# Altium schematic sheet I3C_and_I2C_Slaves.SchDoc
size A4; MPS_Contact: www.monolithicpower.com
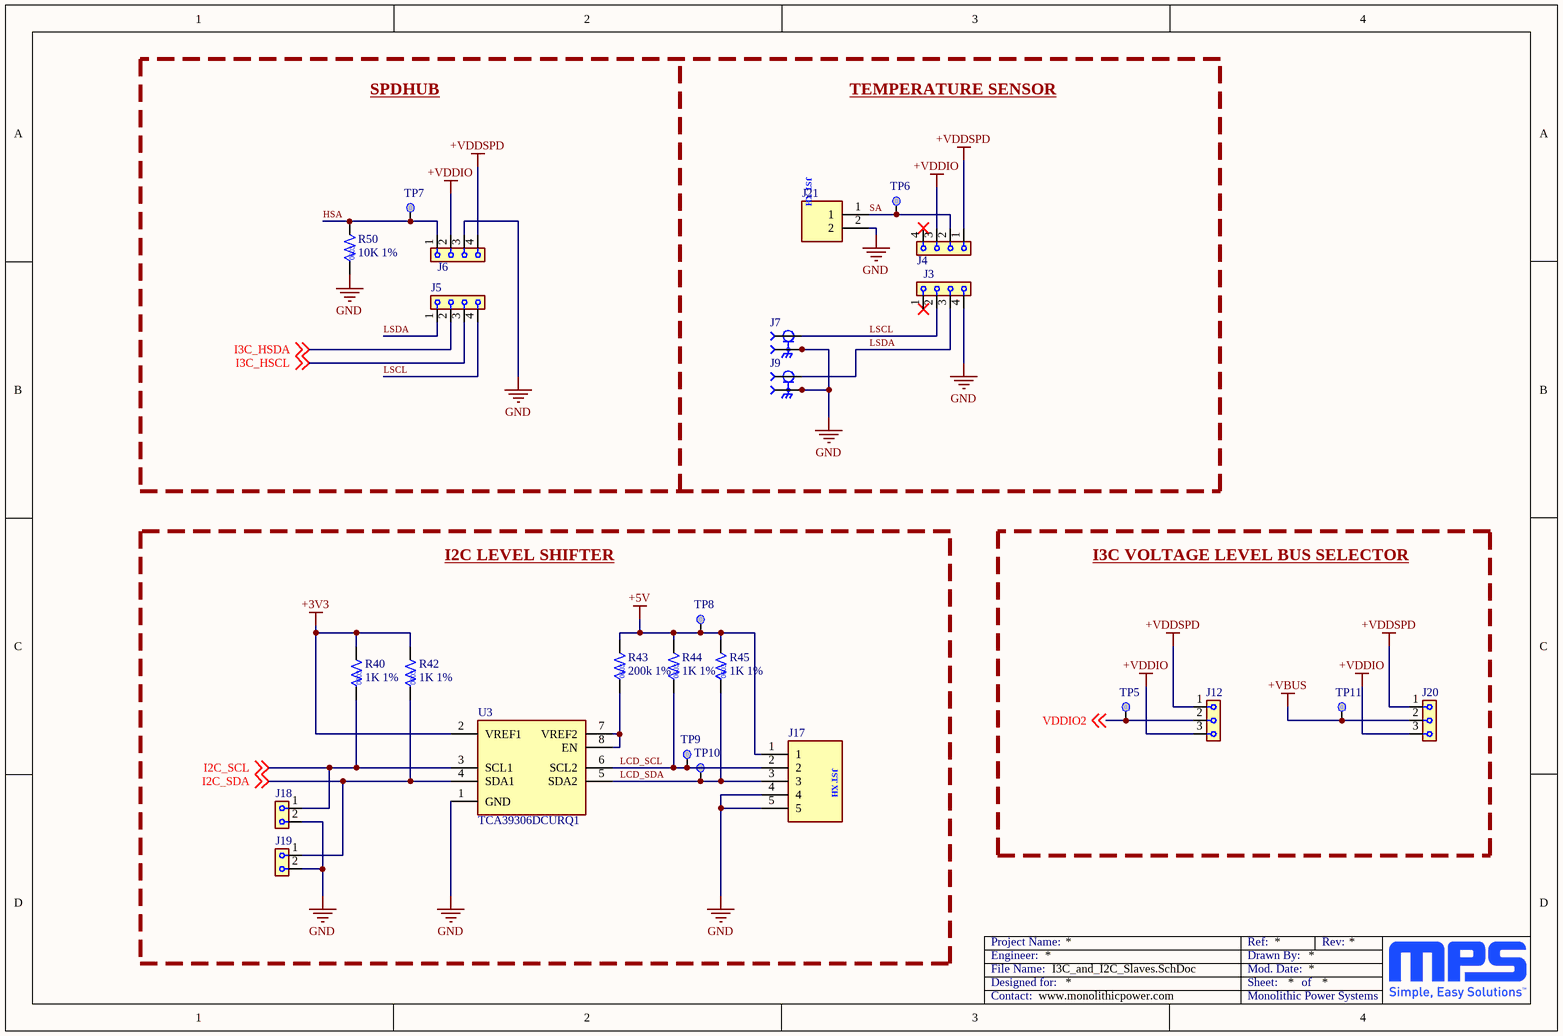
[diagram p0: I3C_and_I2C_Slaves.SchDoc]

## Parts
J3  61300411821  [61300411821]  (value not drawn)
J4  61300411821  [61300411821]  (value not drawn)
J5  61300411821  [61300411821]  (value not drawn)
J6  61300411821  [61300411821]  (value not drawn)
J7  MMCX-J-P-H-ST-TH1  [SAMTEC_MMCX-J-P-H-ST-TH1]  (value not drawn)
J9  MMCX-J-P-H-ST-TH1  [SAMTEC_MMCX-J-P-H-ST-TH1]  (value not drawn)
J12  TSW-103-07-F-S  [HEADER/VERT/1X3/M/P2.54]  (value not drawn)
J17  B5B-XH-A(LF)(SN)  [JST_XH_5V]  (value not drawn)
J18  TSW-102-07-F-S  [HEADER/VERT/1X2/M/P2.54]  (value not drawn)
J19  TSW-102-07-F-S  [HEADER/VERT/1X2/M/P2.54]  (value not drawn)
J20  TSW-103-07-F-S  [HEADER/VERT/1X3/M/P2.54]  (value not drawn)
J21  B2B-XH-A (LF)(SN)  [JST_XH_2V]  (value not drawn)
R40  1K 1%  [CC/NM 0603]
R42  1K 1%  [CC/NM 0603]
R43  200k 1%  [CC/NM 0603]
R44  1K 1%  [CC/NM 0603]
R45  1K 1%  [CC/NM 0603]
R50  10K 1%  [CC/NM 0603]
TP5  Test Point  [TP_SMD_1MM]  (value not drawn)  (no BOM)
TP6  Test Point  [TP_SMD_1MM]  (value not drawn)  (no BOM)
TP7  Test Point  [TP_SMD_1MM]  (value not drawn)  (no BOM)
TP8  Test Point  [TP_SMD_1MM]  (value not drawn)  (no BOM)
TP9  Test Point  [TP_SMD_1MM]  (value not drawn)  (no BOM)
TP10  Test Point  [TP_SMD_1MM]  (value not drawn)  (no BOM)
TP11  Test Point  [TP_SMD_1MM]  (value not drawn)  (no BOM)
U3  TCA39306DCURQ1  [SOP50P310X90-8N]

## Blocks framed on the sheet
I2C LEVEL SHIFTER: J17-J19 R40 R42-R45 TP8-TP10 U3
I3C VOLTAGE LEVEL BUS SELECTOR: J12 J20 TP5 TP11

## Nets
+3V3: R40.2 R42.2 U3.2(VREF1)
+5V: J17.1 R43.2 R44.2 R45.2 TP8.1
+VBUS: J20.2 TP11.1
+VDDIO: J4.3 J6.2 J12.3 J20.3
+VDDSPD: J4.1 J6.4 J12.1 J20.1
GND: J3.4 J6.3 J7.S1 J7.S2 J7.S3 J7.S4 J9.S1 J9.S2 J9.S3 J9.S4 J17.4 J17.5 J18.2 J19.2 J21.2 R50.1 U3.1(GND)
HSA: J6.1 R50.2 TP7.1
I2C_SCL: J18.1 R40.1 U3.3(SCL1) ; off-sheet I2C_SCL
I2C_SDA: J19.1 R42.1 U3.4(SDA1) ; off-sheet I2C_SDA
I3C_HSCL: J5.3 ; off-sheet I3C_HSCL
I3C_HSDA: J5.2 ; off-sheet I3C_HSDA
LCD_SCL: J17.2 R44.1 TP9.1 U3.6(SCL2)
LCD_SDA: J17.3 R45.1 TP10.1 U3.5(SDA2)
LSCL: J3.2 J5.4 J7.1
LSDA: J3.3 J5.1 J9.1
SA: J4.2 J21.1 TP6.1
VDDIO2: J12.2 TP5.1 ; off-sheet VDDIO2
NetR43_1: R43.1 U3.7(VREF2) U3.8(EN)

Not connected (* = marked no-connect by the designer): J3 1*; J4 4*

## Notes on the sheet
- SPDHUB
- TEMPERATURE SENSOR
- Engineer:
- Designed for:
- File Name:
- Project Name:
- Mod. Date:
- Sheet:
- Drawn By:
- Ref:
- of
- Rev:
- Contact:
- Monolithic Power Systems
- (in symbol B2B-XH-A (LF)(SN)) JST XH
- (in symbol B5B-XH-A(LF)(SN)) JST XH

## Library data of the parts
J3-J6 = 61300411821: 2.54mm Scket Header 4 pins; Manufacturer: Wurth Elektronik; DrownBy: Xavier Rocher; Datasheet: https://www.we-online.com/components/products/datasheet/61300411821.pdf; Package: 0603; Supplier 1: Digikey; Supplier  Part Number 1: 732-61300411821-ND; Supplier 2: Mouser; Supplier  Part Number 2: 710-61300411821; Manufacturer Part Number: 61300411821; Value: 61300411821
J7 J9 = MMCX-J-P-H-ST-TH1: RF Connectors / Coaxial Connectors 50 OHM MMCX JACK OR PLUG; Manufacturer: Samtec Inc.; DrownBy: Xavier Rocher; Datasheet: https://mm.digikey.com/Volume0/opasdata/d220001/medias/docus/6129/mmcx-j-p-x-st-th1-mkt.pdf; Package: 0603; Supplier 1: Digikey; Supplier  Part Number 1: SAM10617-ND; Supplier 2: Mouser; Supplier  Part Number 2: 200-MMCXJPHSTTH1; Manufacturer Part Number: MMCX-J-P-H-ST-TH1; Value: MMCX-J-P-H-ST-TH1
J12 J20 = TSW-103-07-F-S: Pin Header, Unshrouded, Board-to-Board, 2.54 mm, 1 Rows, 3 Contacts, Through Hole, TSW; Manufacturer: SAMTEC; DrownBy: Xavier Rocher; Datasheet: https://www.farnell.com/datasheets/1701645.pdf?_gl=1*1o3ly18*_gcl_aw*R0NMLjE3NzI0NTg0MDAuQ2p3S0NBaUFoNVhOQmhBQUVpd0FfQnU4RlFpaGh0aTJCR0F1SXBlQ2pXMWtFYmlZc2JraDRpajgydjZyT2lxVUUtZHBLLW80X0NoNy1Sb0NSZjhRQXZEX0J3RQ..*_gcl_au*MjEwMjY0Mzg0MC4xNzcyNDM5MTYx; Package: 0603; Supplier 1: Farnell; Supplier  Part Number 1: 2505043; Supplier 2: Mouser; Supplier  Part Number 2: 200-TSW10307FS; Manufacturer Part Number: TSW-103-07-F-S; Value: TSW-103-07-F-S
J17 = B5B-XH-A(LF)(SN): Alojamientos de cables y cabecera XH HEADER (TOP); Manufacturer: JST; DrownBy: Xavier Rocher; Package: XH; Supplier 1: Farnell; Supplier  Part Number 1: 1516281; Supplier 2: Mouser; Supplier  Part Number 2: 306-B5BXHALFSN; Manufacturer Part Number: B5B-XH-A(LF)(SN); Automotive: https://www.mouser.es/datasheet/3/1070/1/eXH.pdf; Value: B5B-XH-A(LF)(SN)
J18 J19 = TSW-102-07-F-S: Alojamientos de cables y cabecera 2.54MM CLASSIC PCB HDR STRIP; Manufacturer: SAMTEC; DrownBy: Xavier Rocher; Datasheet: https://www.farnell.com/datasheets/1701645.pdf?_gl=1*1o3ly18*_gcl_aw*R0NMLjE3NzI0NTg0MDAuQ2p3S0NBaUFoNVhOQmhBQUVpd0FfQnU4RlFpaGh0aTJCR0F1SXBlQ2pXMWtFYmlZc2JraDRpajgydjZyT2lxVUUtZHBLLW80X0NoNy1Sb0NSZjhRQXZEX0J3RQ..*_gcl_au*MjEwMjY0Mzg0MC4xNzcyNDM5MTYx; Package: 0603; Supplier 1: Farnell; Supplier  Part Number 1: 2779661; Supplier 2: Mouser; Supplier  Part Number 2: 200-TSW10207FS; Manufacturer Part Number: TSW-102-07-F-S; Value: TSW-102-07-F-S
J21 = B2B-XH-A (LF)(SN): Alojamientos de cables y cabecera 2.54MM CLASSIC PCB HDR STRIP; Manufacturer: JST; DrownBy: Xavier Rocher; Datasheet: https://www.farnell.com/datasheets/2057209.pdf?_gl=1*1fl0mut*_gcl_aw*R0NMLjE3NzI0NTg0MDAuQ2p3S0NBaUFoNVhOQmhBQUVpd0FfQnU4RlFpaGh0aTJCR0F1SXBlQ2pXMWtFYmlZc2JraDRpajgydjZyT2lxVUUtZHBLLW80X0NoNy1Sb0NSZjhRQXZEX0J3RQ..*_gcl_au*MjEwMjY0Mzg0MC4xNzcyNDM5MTYx; Package: XH; Supplier 1: Farnell; Supplier  Part Number 1: 1516276; Supplier 2: Mouser; Supplier  Part Number 2: 306-B2BXHALFSNP; Manufacturer Part Number: B2B-XH-A (LF)(SN); Value: B2B-XH-A (LF)(SN)
R40 R42 R44 R45 = RT0603BRD101KL: Manufacturer: YAGEO; DrownBy: Xavier Rocher; Package: 0603; Supplier 1: Farnell; Supplier  Part Number 1: 3496584; Supplier 2: Mouser; Supplier  Part Number 2: 603-RT0603BRD101KL; Manufacturer Part Number: RT0603BRD101KL; Value: 1K 1%
R43 = CRCW0603200KFHEAP: Resistores de película gruesa - SMD D11/CRCW0603-P 50 200K 1% ET1 e3; DrownBy: Xavier Rocher; Package: 0603; Supplier 1: Digikey; Supplier  Part Number 1: CRCW0603200KFHEAP-ND; Supplier 2: Mouser; Supplier  Part Number 2: 71-CRCW0603200KFHEAP; Manufacturer Part Number: CRCW0603200KFHEAP; Value: 200k 1%
R50 = AC0603FR-0710KL: Manufacturer: YAGEO; DrownBy: Xavier Rocher; Package: 0603; Supplier 1: Farnell; Supplier  Part Number 1: 2363472; Supplier 2: Mouser; Supplier  Part Number 2: 603-AC0603FR-0710KL; Manufacturer Part Number: AC0603FR-0710KL; Value: 10K 1%
TP5-TP11 = Test_Point_1mm: Test Point 1mm; Internal_Part_Number: MCD-00074; Part_Type: Mechanical; Status: Released; Manufacturer_Part_Number: n/a; Manufacturer: n/a; ComponentLink1Description: Datasheet; ComponentLink1URL: http://na; Provided_By: n/a; ECCN_US: n/a; ECCN_EU: n/a
U3 = TCA39306DCURQ1: Manufacturer: TI; DrownBy: Xavier Rocher; Datasheet: https://www.ti.com/lit/ds/symlink/tca39306-q1.pdf?ts=1772335428960; Package: VSSOP-8; Supplier 1: Digikey; Supplier  Part Number 1: 296-TCA39306DCURQ1TR-ND; Supplier 2: Mouser; Supplier  Part Number 2: 595-TCA39306DCURQ1; Manufacturer Part Number: TCA39306DCURQ1; Automotive: Yes; Value: TCA39306DCURQ1